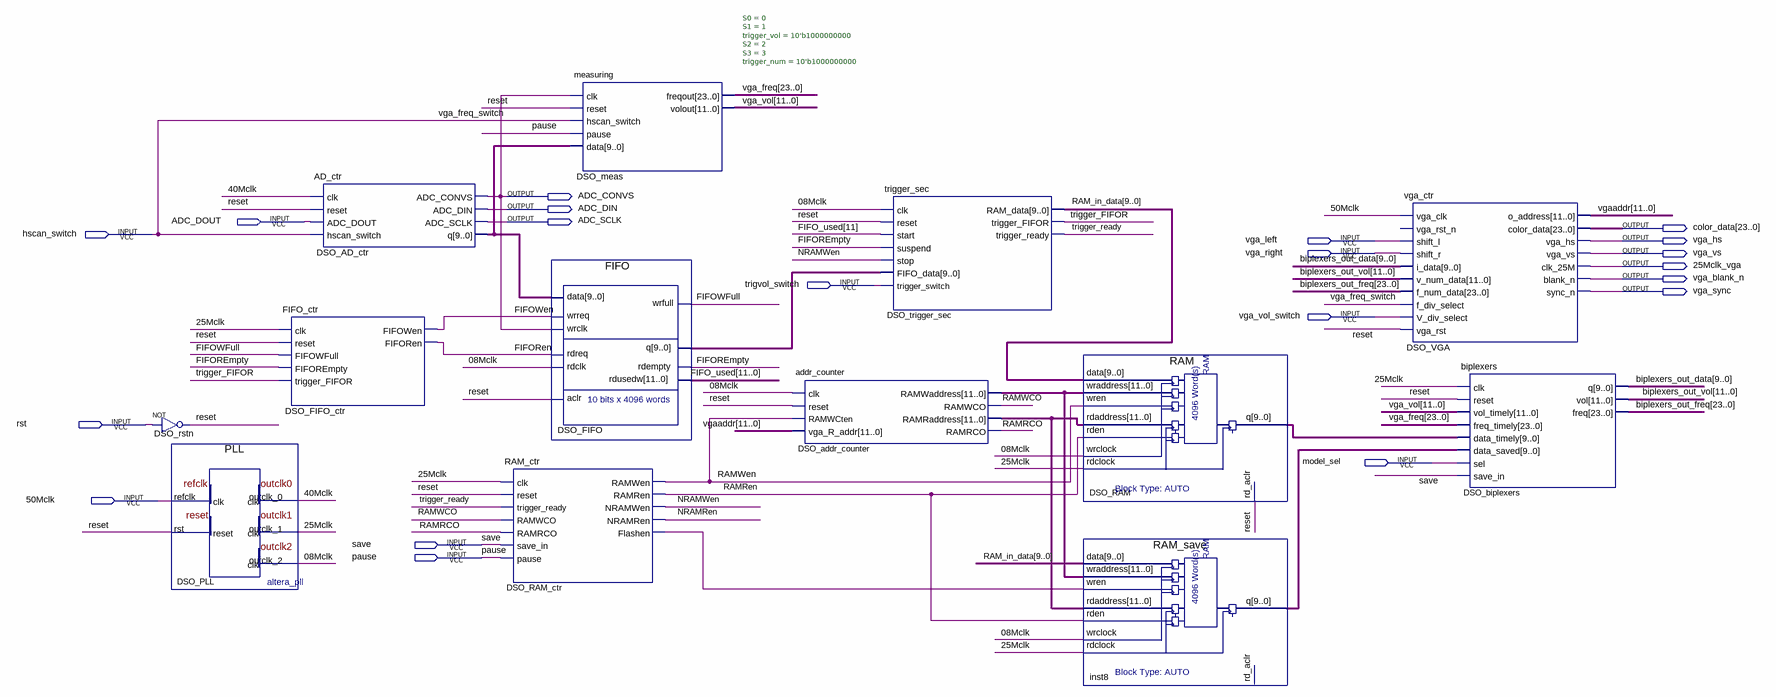
[diagram p0: schematic sheet]
// Quartus schematic DSO.bdf as structural Verilog: 13 symbols, 20 pins
module DSO (
  input  ADC_DOUT,
  input  hscan_switch,
  input  vga_left,
  input  vga_right,
  input  trigvol_switch,
  input  vga_vol_switch,
  input  rst,
  input  model_sel,
  input  \50Mclk ,
  input  save,
  input  pause,
  output ADC_CONVS,
  output ADC_DIN,
  output ADC_SCLK,
  output [23:0] color_data,
  output vga_hs,
  output vga_vs,
  output \25Mclk_vga ,
  output vga_blank_n,
  output vga_sync
);

  wire \08Mclk , \25Mclk , \40Mclk , DSO_RAM_ctr_flashen, FIFOREmpty, FIFORen, FIFOWen, FIFOWFull, NRAMRen,
       NRAMWen, RAMRCO, RAMRen, RAMWCO, RAMWen, reset, trigger_FIFOR, trigger_ready;
  wire [9:0] biplexers_out_data, DSO_AD_ctr_q, DSO_FIFO_q, DSO_RAM_q, inst8_q, RAM_in_data;
  wire [11:0] biplexers_out_vol, DSO_addr_counter_ramraddress, DSO_addr_counter_ramwaddress, FIFO_used,
       vga_vol, vgaaddr;
  wire [23:0] biplexers_out_freq, vga_freq;

  not DSO_rstn (reset, rst);
  PLL DSO_PLL (.refclk(\50Mclk ), .rst(reset), .outclk_0(\40Mclk ), .outclk_1(\25Mclk ), .outclk_2(\08Mclk ));
  FIFO_ctr DSO_FIFO_ctr (
    .clk(\25Mclk ), .reset(reset), .FIFOWFull(FIFOWFull), .FIFOREmpty(FIFOREmpty),
    .trigger_FIFOR(trigger_FIFOR), .FIFOWen(FIFOWen), .FIFORen(FIFORen));
  AD_ctr DSO_AD_ctr (
    .clk(\40Mclk ), .reset(reset), .ADC_DOUT(ADC_DOUT), .hscan_switch(hscan_switch), .ADC_CONVS(ADC_CONVS),
    .ADC_DIN(ADC_DIN), .ADC_SCLK(ADC_SCLK), .q(DSO_AD_ctr_q));
  RAM_ctr DSO_RAM_ctr (
    .clk(\25Mclk ), .reset(reset), .trigger_ready(trigger_ready), .RAMWCO(RAMWCO), .RAMRCO(RAMRCO),
    .save_in(save), .pause(pause), .RAMWen(RAMWen), .RAMRen(RAMRen), .NRAMWen(NRAMWen), .NRAMRen(NRAMRen),
    .Flashen(DSO_RAM_ctr_flashen));
  FIFO DSO_FIFO (
    .data(DSO_AD_ctr_q), .wrreq(FIFOWen), .wrclk(ADC_CONVS), .rdreq(FIFORen), .rdclk(\08Mclk ), .aclr(reset),
    .wrfull(FIFOWFull), .q(DSO_FIFO_q), .rdempty(FIFOREmpty), .rdusedw(FIFO_used));
  measuring #(.S0(0), .S1(1), .trigger_vol(10'b1000000000), .S2(2), .S3(3), .trigger_num(10'b1000000000)) DSO_meas (
    .clk(ADC_CONVS), .reset(reset), .hscan_switch(hscan_switch), .pause(pause), .data(DSO_AD_ctr_q),
    .freqout(vga_freq), .volout(vga_vol));
  addr_counter DSO_addr_counter (
    .clk(\08Mclk ), .reset(reset), .RAMWCten(RAMWen), .vga_R_addr(vgaaddr),
    .RAMWaddress(DSO_addr_counter_ramwaddress), .RAMWCO(RAMWCO), .RAMRaddress(DSO_addr_counter_ramraddress),
    .RAMRCO(RAMRCO));
  trigger_sec DSO_trigger_sec (
    .clk(\08Mclk ), .reset(reset), .start(FIFO_used[11]), .suspend(FIFOREmpty), .stop(NRAMWen),
    .FIFO_data(DSO_FIFO_q), .trigger_switch(trigvol_switch), .RAM_data(RAM_in_data),
    .trigger_FIFOR(trigger_FIFOR), .trigger_ready(trigger_ready));
  RAM DSO_RAM (
    .data(RAM_in_data), .wraddress(DSO_addr_counter_ramwaddress), .wren(RAMWen),
    .rdaddress(DSO_addr_counter_ramraddress), .rden(RAMRen), .wrclock(\08Mclk ), .rdclock(\25Mclk ),
    .rd_aclr(reset), .q(DSO_RAM_q));
  RAM_save inst8 (
    .data(RAM_in_data), .wraddress(DSO_addr_counter_ramwaddress), .wren(DSO_RAM_ctr_flashen),
    .rdaddress(DSO_addr_counter_ramraddress), .rden(RAMRen), .wrclock(\08Mclk ), .rdclock(\25Mclk ),
    .q(inst8_q));  // open: rd_aclr
  vga_ctr DSO_VGA (
    .vga_clk(\50Mclk ), .shift_l(vga_left), .shift_r(vga_right), .i_data(biplexers_out_data),
    .v_num_data(biplexers_out_vol), .f_num_data(biplexers_out_freq), .f_div_select(hscan_switch),
    .V_div_select(vga_vol_switch), .vga_rst(reset), .o_address(vgaaddr), .color_data(color_data),
    .vga_hs(vga_hs), .vga_vs(vga_vs), .clk_25M(\25Mclk_vga ), .blank_n(vga_blank_n), .sync_n(vga_sync));  // open: vga_rst_n
  biplexers DSO_biplexers (
    .clk(\25Mclk ), .reset(reset), .vol_timely(vga_vol), .freq_timely(vga_freq), .data_timely(DSO_RAM_q),
    .data_saved(inst8_q), .sel(model_sel), .save_in(save), .q(biplexers_out_data), .vol(biplexers_out_vol),
    .freq(biplexers_out_freq));

  // Other names for the same wires on the sheet: vga_freq_switch = hscan_switch
endmodule
